# Altium schematic sheet [02] - REVISION HISTORY.SchDoc: Test title
size A4; Project name:: Test name; Client: DSG; Date: YYYY-MM-DD; CheckedBy: Bartosz Kowierski; DrawnBy: Paweł Poryzała; Engineer: X; Revision: 0.9; Size: A4; Contact: datasystem.pl
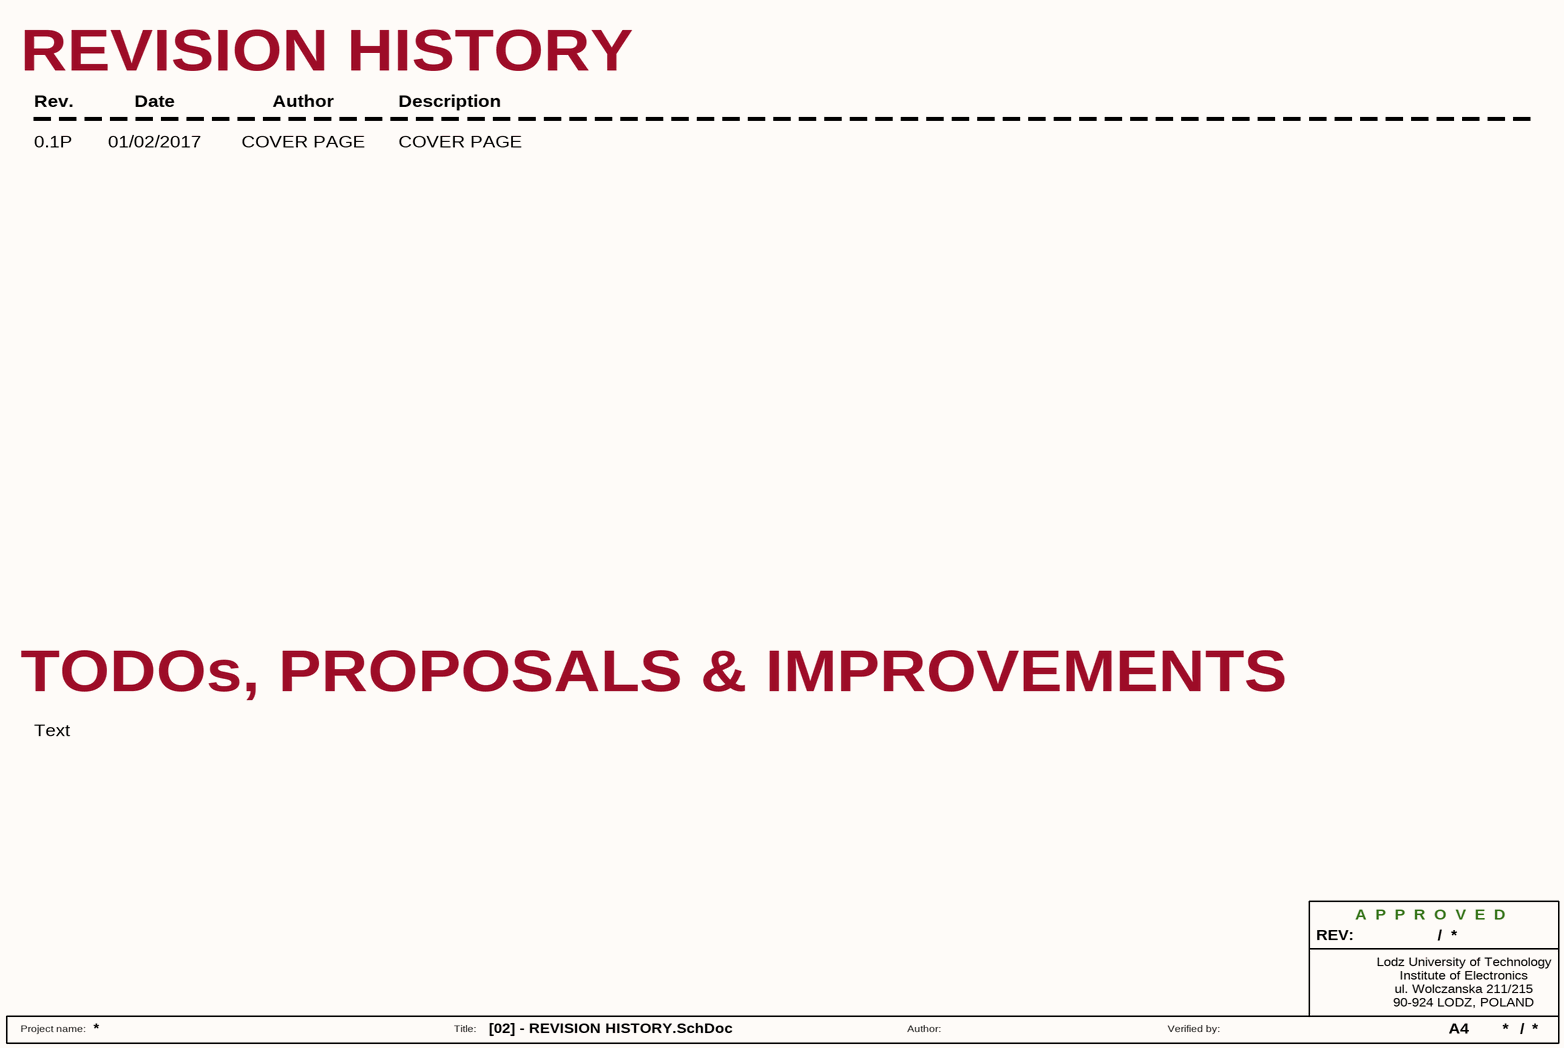
[diagram p0: [02] - REVISION HISTORY.SchDoc]

## Notes on the sheet
- REVISION HISTORY
- Rev.
- Date
- Author
- Description
- 0.1P
- 01/02/2017
- COVER PAGE
- TODOs, PROPOSALS & IMPROVEMENTS
- Text
- REV:
- A  P  P  R  O  V  E  D
- /
- Lodz University of Technology
- ul. Wolczanska 211/215
- 90-924 LODZ, POLAND
- Institute of Electronics
- Project name:
- Title:
- Author:
- Verified by: